# EAGLE schematic display (EAGLE 9.5.2)

## Sheet 1 of 2
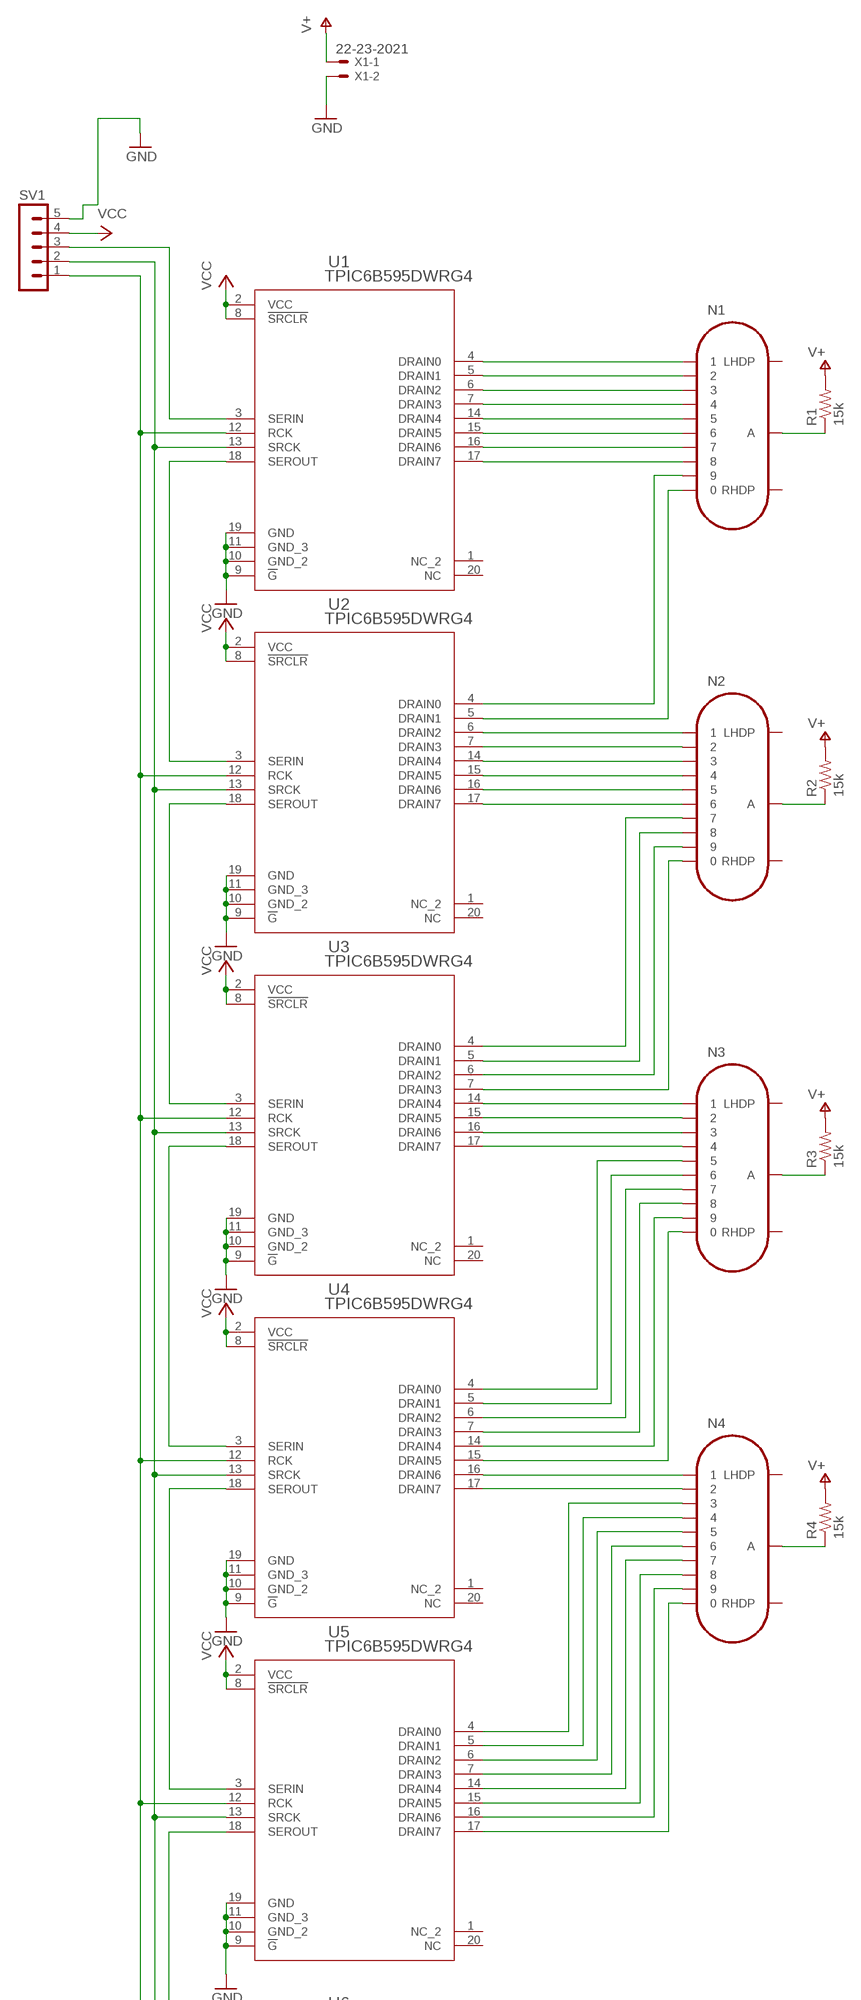
[diagram p0: schematic, sheet 1, part 1 of 2]
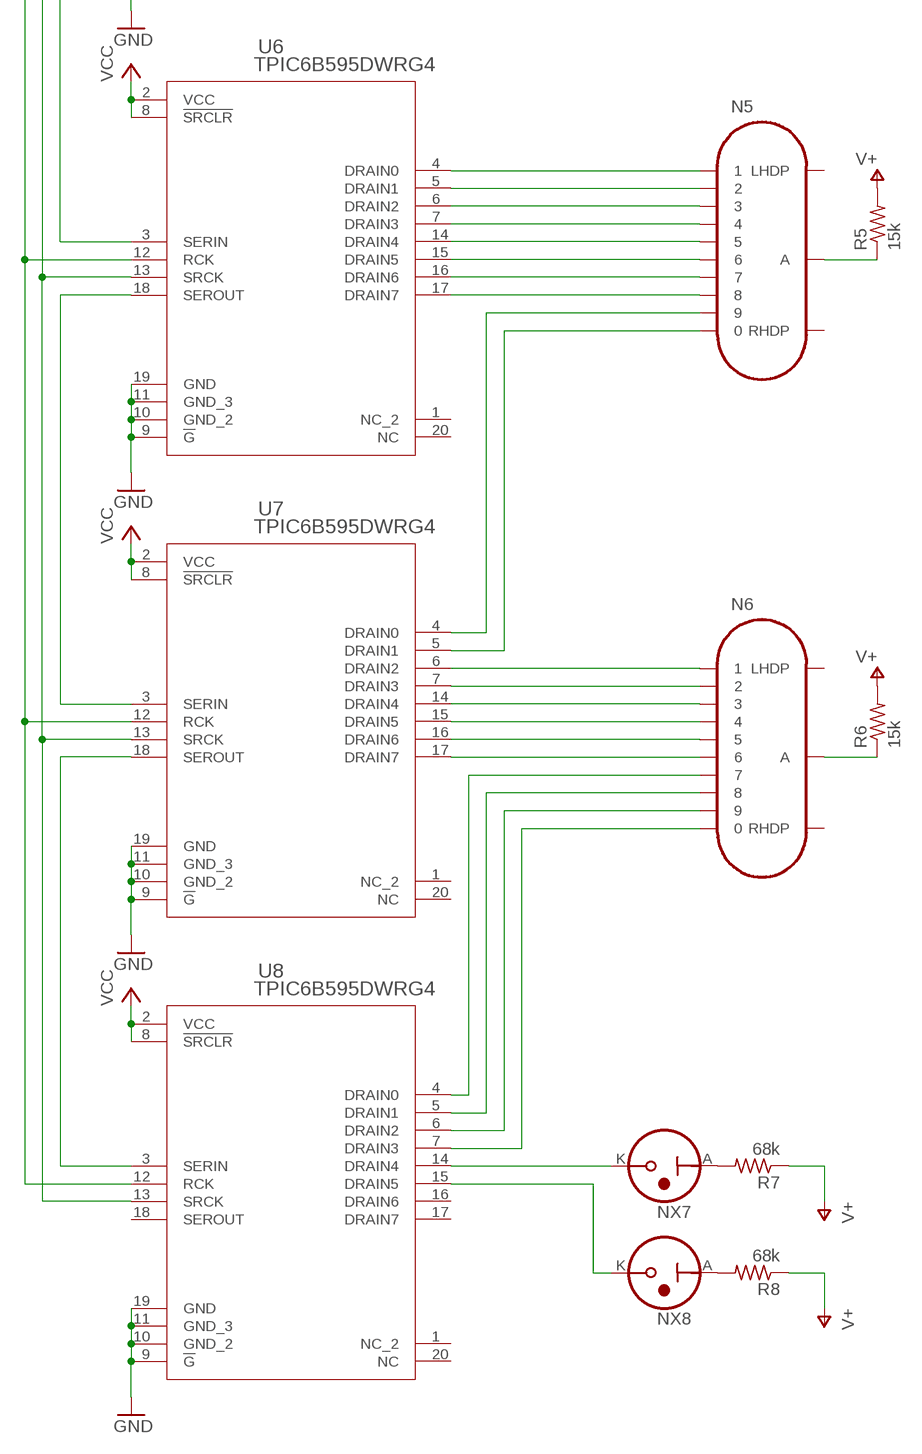
[diagram p1: schematic, sheet 1, part 2 of 2]

### Parts
N1  IN-16  [IN-16]
N2  IN-16  [IN-16]
N3  IN-16  [IN-16]
N4  IN-16  [IN-16]
N5  IN-16  [IN-16]
N6  IN-16  [IN-16]
NX7  IN-3  [IN-3]
NX8  IN-3  [IN-3]
R1  15k  R-US_R0805  [R0805]
R2  15k  R-US_R0805  [R0805]
R3  15k  R-US_R0805  [R0805]
R4  15k  R-US_R0805  [R0805]
R5  15k  R-US_R0805  [R0805]
R6  15k  R-US_R0805  [R0805]
R7  68k  R-US_R0805  [R0805]
R8  68k  R-US_R0805  [R0805]
SV1  MA05-1  [MA05-1]
U1  TPIC6B595DWRG4  [DW20]
U2  TPIC6B595DWRG4  [DW20]
U3  TPIC6B595DWRG4  [DW20]
U4  TPIC6B595DWRG4  [DW20]
U5  TPIC6B595DWRG4  [DW20]
U6  TPIC6B595DWRG4  [DW20]
U7  TPIC6B595DWRG4  [DW20]
U8  TPIC6B595DWRG4  [DW20]
X1  22-23-2021  [22-23-2021]

### Nets
GND: SV1.5 U1.9(!G) U1.10(GND_2) U1.11(GND_3) U1.19(GND) U2.9(!G) U2.10(GND_2) U2.11(GND_3) U2.19(GND) U3.9(!G) U3.10(GND_2) U3.11(GND_3) U3.19(GND) U4.9(!G) U4.10(GND_2) U4.11(GND_3) U4.19(GND) U5.9(!G) U5.10(GND_2) U5.11(GND_3) U5.19(GND) U6.9(!G) U6.10(GND_2) U6.11(GND_3) U6.19(GND) U7.9(!G) U7.10(GND_2) U7.11(GND_3) U7.19(GND) U8.9(!G) U8.10(GND_2) U8.11(GND_3) U8.19(GND) X1.2
N$1: N1.1 U1.4(DRAIN0)
N$2: N1.2 U1.5(DRAIN1)
N$3: N1.3 U1.6(DRAIN2)
N$4: N1.4 U1.7(DRAIN3)
N$5: N1.5 U1.14(DRAIN4)
N$6: N1.6 U1.15(DRAIN5)
N$7: N1.7 U1.16(DRAIN6)
N$8: N1.8 U1.17(DRAIN7)
N$9: N1.9 U2.4(DRAIN0)
N$10: N1.0 U2.5(DRAIN1)
N$11: N2.1 U2.6(DRAIN2)
N$12: N2.2 U2.7(DRAIN3)
N$13: N2.3 U2.14(DRAIN4)
N$14: N2.4 U2.15(DRAIN5)
N$15: N2.5 U2.16(DRAIN6)
N$16: N2.6 U2.17(DRAIN7)
N$17: N2.7 U3.4(DRAIN0)
N$18: N2.8 U3.5(DRAIN1)
N$19: N2.9 U3.6(DRAIN2)
N$20: N2.0 U3.7(DRAIN3)
N$22: NX7.A R7.2
N$23: N1.A R1.1
N$24: N2.A R2.1
N$25: N3.A R3.1
N$26: N4.A R4.1
N$27: U4.18(SEROUT) U5.3(SERIN)
N$28: SV1.1 U1.12(RCK) U2.12(RCK) U3.12(RCK) U4.12(RCK) U5.12(RCK) U6.12(RCK) U7.12(RCK) U8.12(RCK)
N$29: N3.1 U3.14(DRAIN4)
N$30: N3.2 U3.15(DRAIN5)
N$31: N3.3 U3.16(DRAIN6)
N$32: N3.4 U3.17(DRAIN7)
N$33: N3.8 U4.7(DRAIN3)
N$34: N3.6 U4.5(DRAIN1)
N$35: N3.9 U4.14(DRAIN4)
N$36: N3.5 U4.4(DRAIN0)
N$37: N3.7 U4.6(DRAIN2)
N$38: N3.0 U4.15(DRAIN5)
N$39: N4.1 U4.16(DRAIN6)
N$40: N4.2 U4.17(DRAIN7)
N$41: N4.0 U5.17(DRAIN7)
N$42: N4.9 U5.16(DRAIN6)
N$43: N4.8 U5.15(DRAIN5)
N$44: N4.7 U5.14(DRAIN4)
N$45: N4.6 U5.7(DRAIN3)
N$46: N4.5 U5.6(DRAIN2)
N$47: N4.4 U5.5(DRAIN1)
N$48: N4.3 U5.4(DRAIN0)
N$49: SV1.2 U1.13(SRCK) U2.13(SRCK) U3.13(SRCK) U4.13(SRCK) U5.13(SRCK) U6.13(SRCK) U7.13(SRCK) U8.13(SRCK)
N$50: U5.18(SEROUT) U6.3(SERIN)
N$51: N5.A R5.1
N$52: SV1.3 U1.3(SERIN)
N$53: N6.A R6.1
N$56: N5.0 U7.5(DRAIN1)
N$57: N5.7 U6.16(DRAIN6)
N$58: N5.6 U6.15(DRAIN5)
N$59: N5.5 U6.14(DRAIN4)
N$60: N5.4 U6.7(DRAIN3)
N$61: N5.3 U6.6(DRAIN2)
N$62: N5.2 U6.5(DRAIN1)
N$63: N5.1 U6.4(DRAIN0)
N$64: U6.18(SEROUT) U7.3(SERIN)
N$67: N5.8 U6.17(DRAIN7)
N$68: N5.9 U7.4(DRAIN0)
N$69: U7.18(SEROUT) U8.3(SERIN)
N$72: N6.1 U7.6(DRAIN2)
N$73: N6.2 U7.7(DRAIN3)
N$74: N6.3 U7.14(DRAIN4)
N$75: N6.4 U7.15(DRAIN5)
N$76: N6.5 U7.16(DRAIN6)
N$77: U1.18(SEROUT) U2.3(SERIN)
N$78: U2.18(SEROUT) U3.3(SERIN)
N$79: U3.18(SEROUT) U4.3(SERIN)
N$80: N6.6 U7.17(DRAIN7)
N$81: N6.7 U8.4(DRAIN0)
N$82: N6.8 U8.5(DRAIN1)
N$83: N6.9 U8.6(DRAIN2)
N$84: N6.0 U8.7(DRAIN3)
N$85: NX8.A R8.2
N$88: NX7.K U8.14(DRAIN4)
N$89: NX8.K U8.15(DRAIN5)
V+: R1.2 R2.2 R3.2 R4.2 R5.2 R6.2 R7.1 R8.1 X1.1
VCC: SV1.4 U1.2(VCC) U1.8(!SRCLR) U2.2(VCC) U2.8(!SRCLR) U3.2(VCC) U3.8(!SRCLR) U4.2(VCC) U4.8(!SRCLR) U5.2(VCC) U5.8(!SRCLR) U6.2(VCC) U6.8(!SRCLR) U7.2(VCC) U7.8(!SRCLR) U8.2(VCC) U8.8(!SRCLR)
Unconnected: N1.LHDP N1.RHDP N2.LHDP N2.RHDP N3.LHDP N3.RHDP N4.LHDP N4.RHDP N5.LHDP N5.RHDP N6.LHDP N6.RHDP U1.1(NC_2) U1.20(NC) U2.1(NC_2) U2.20(NC) U3.1(NC_2) U3.20(NC) U4.1(NC_2) U4.20(NC) U5.1(NC_2) U5.20(NC) U6.1(NC_2) U6.20(NC) U7.1(NC_2) U7.20(NC) U8.1(NC_2) U8.16(DRAIN6) U8.17(DRAIN7) U8.18(SEROUT) U8.20(NC)

## Sheet 2 of 2

## Library data of the parts
N1-N6 = nixies-us:IN-16: IN-16: small numeric frontview nixie tube
NX7 NX8 = nixies-us:IN-3: IN-3: nixie bulb
R1-R8 = rcl:R-US_: RESISTOR, American symbol; SPICEPREFIX: R
SV1 = con-lstb:MA05-1: PIN HEADER; OC_FARNELL: unknown; OC_NEWARK: unknown
U1-U8 = Digikey:TPIC6B595DWRG4; BUILT_BY: EMA_UL_Team; MANUFACTURER: Texas Instruments; MANUFACTURER_PART_NUMBER: TPIC6B595DWRG4; VENDOR: Texas Instruments
X1 = con-molex:22-23-2021: .100" (2.54mm) Center Header - 2 Pin; MF: MOLEX; MPN: 22-23-2021; OC_FARNELL: 1462926; OC_NEWARK: 25C3832

## Net classes
0 default: width 0.254 mm, clearance 0.381 mm